# Altium schematic sheet CGA0603X7R104K500JT.schdoc
size 127 x 101 mm
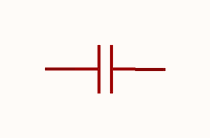
[diagram p0: CGA0603X7R104K500JT.schdoc]

## Parts
C?  cga0603x7r104k500jt  [C0603]  (value not drawn)

## Nets

Not connected (* = marked no-connect by the designer): C? 1 2

## Library data of the parts
C? = cga0603x7r104k500jt: 容值:100nF;精度:±10%;额定电压:50V;温度系数:X7R;; Manufacturer: HRE(芯声); AddInBom: yes; ModelId: ac125912035d415993ca9572d50418b1; ModelName: C0603_L1.6-W0.8-H0.8; ModelTransform: 62.992,31.496,0,0,0,0,0,0,0; Value: 100nF; Tolerance: ±10%; Voltage Rating: 50V; Temperature Coefficient: X7R; Symbol: CGA0603X7R104K500JT; LCSC Part Name: 100nF ±10% 50V; SupplierPart: C6119867; ManufacturerPart: CGA0603X7R104K500JT; Supplier Footprint: 0603; JLCPCB Part Class: Extended Part; Datasheet: https://item.szlcsc.com/datasheet/CGA0603X7R104K500JT/7062573.html; Supplier: LCSC; ConvertToPcb: yes; FootprintName: C0603